# Altium schematic sheet BalloonV1.SchDoc
size 599 x 599 mm
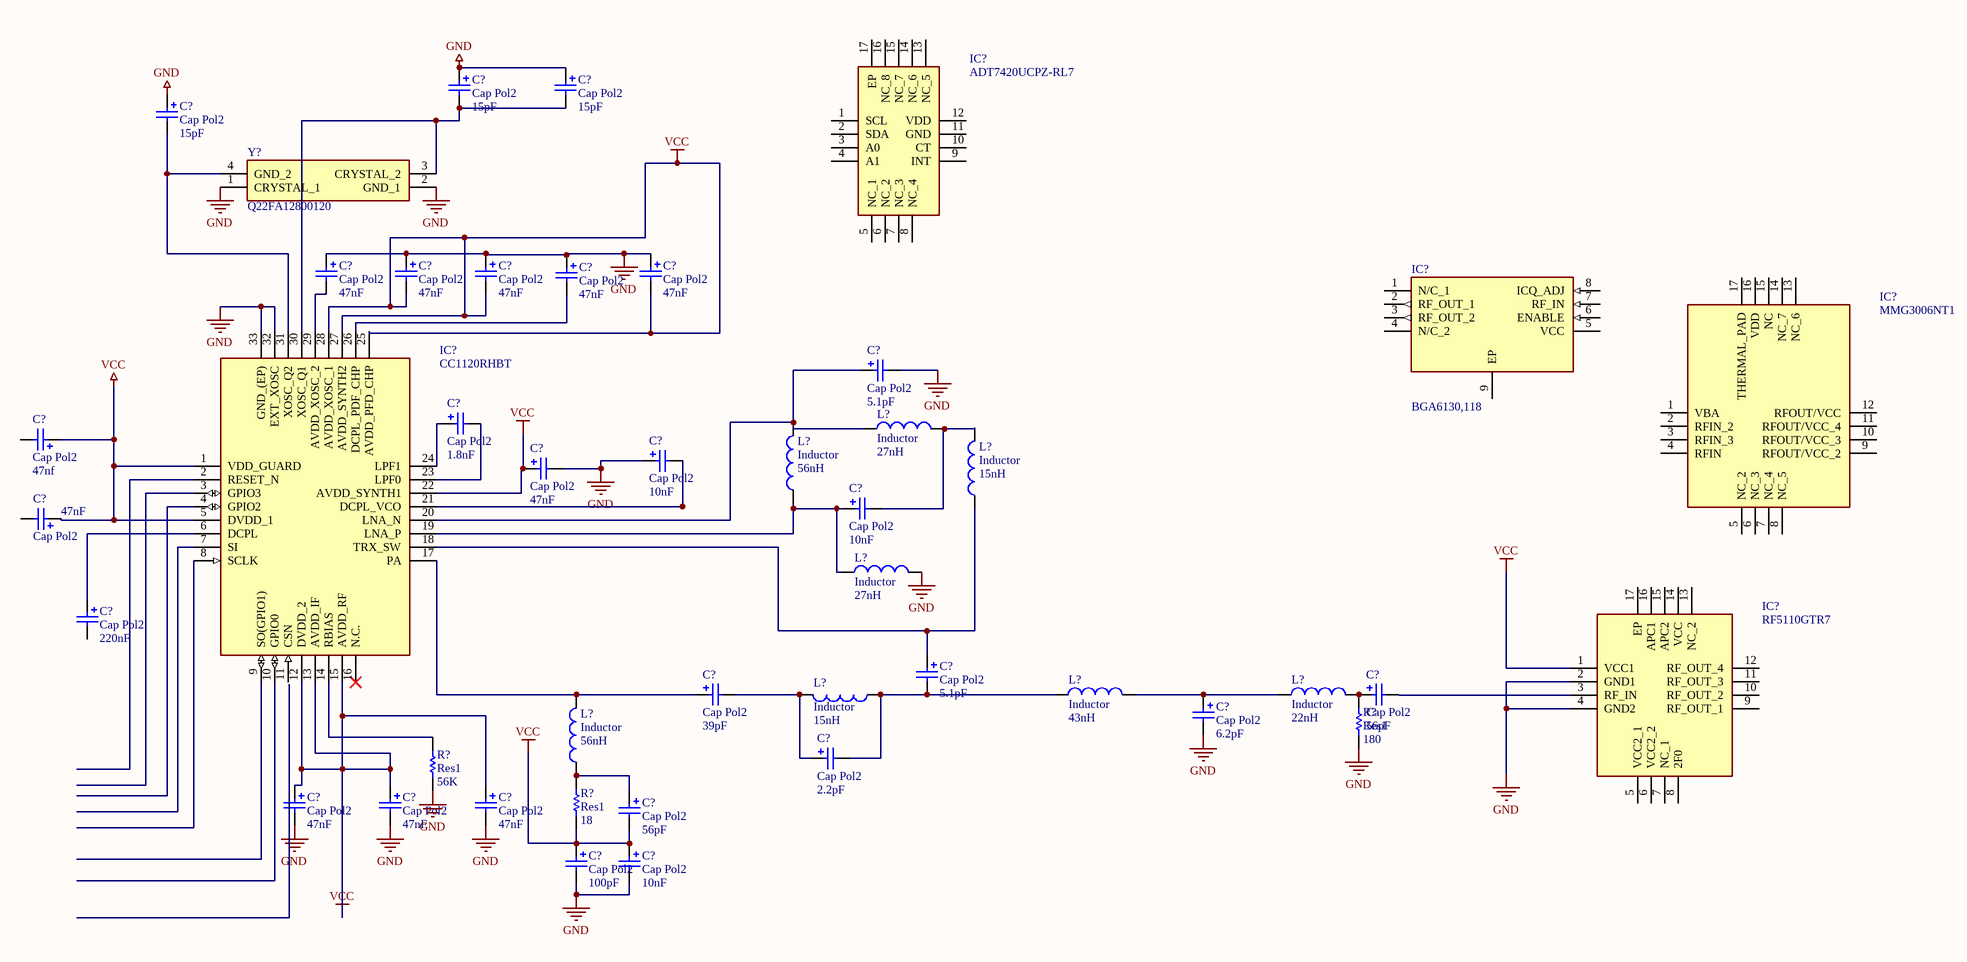
[diagram p0: BalloonV1.SchDoc]

## Parts
(Parts that share a designator on the sheet are numbered #1, #2 ... from top to bottom, then left to right.)
C?#1  Cap Pol2  value 15pF  [POLAR0.8]
C?#2  Cap Pol2  value 15pF  [POLAR0.8]
C?#3  Cap Pol2  value 15pF  [POLAR0.8]
C?#4  Cap Pol2  value 47nF  [POLAR0.8]
C?#5  Cap Pol2  value 47nF  [POLAR0.8]
C?#6  Cap Pol2  value 47nF  [POLAR0.8]
C?#7  Cap Pol2  value 47nF  [POLAR0.8]
C?#8  Cap Pol2  value 47nF  [POLAR0.8]
C?#9  Cap Pol2  value 5.1pF  [POLAR0.8]
C?#10  Cap Pol2  value 1.8nF  [POLAR0.8]
C?#11  Cap Pol2  value 47nf  [POLAR0.8]
C?#12  Cap Pol2  value 10nF  [POLAR0.8]
C?#13  Cap Pol2  value 47nF  [POLAR0.8]
C?#14  Cap Pol2  value 10nF  [POLAR0.8]
C?#15  Cap Pol2  value 47nF  [POLAR0.8]
C?#16  Cap Pol2  value 220nF  [POLAR0.8]
C?#17  Cap Pol2  value 5.1pF  [POLAR0.8]
C?#18  Cap Pol2  value 39pF  [POLAR0.8]
C?#19  Cap Pol2  value 56pF  [POLAR0.8]
C?#20  Cap Pol2  value 6.2pF  [POLAR0.8]
C?#21  Cap Pol2  value 2.2pF  [POLAR0.8]
C?#22  Cap Pol2  value 47nF  [POLAR0.8]
C?#23  Cap Pol2  value 47nF  [POLAR0.8]
C?#24  Cap Pol2  value 47nF  [POLAR0.8]
C?#25  Cap Pol2  value 56pF  [POLAR0.8]
C?#26  Cap Pol2  value 100pF  [POLAR0.8]
C?#27  Cap Pol2  value 10nF  [POLAR0.8]
IC?#1  ADT7420UCPZ-RL7  [QFN65P400X400X80-17N-D]
IC?#2  BGA6130,118  [SON50P300X300X100-9N]
IC?#3  MMG3006NT1  [QFN65P400X400X90-17N]
IC?#4  CC1120RHBT  [QFN50P500X500X100-33N-D]
IC?#5  RF5110GTR7  [QFN50P300X300X90-17N-D]
L?#1  Inductor  value 27nH  [0402-A]
L?#2  Inductor  value 56nH  [0402-A]
L?#3  Inductor  value 15nH  [0402-A]
L?#4  Inductor  value 27nH  [0402-A]
L?#5  Inductor  value 43nH  [0402-A]
L?#6  Inductor  value 22nH  [0402-A]
L?#7  Inductor  value 15nH  [0402-A]
L?#8  Inductor  value 56nH  [0402-A]
R?#1  Res1  value 180  [AXIAL-0.3]
R?#2  Res1  value 56K  [AXIAL-0.3]
R?#3  Res1  value 18  [AXIAL-0.3]
Y?  Q22FA12800120  [Q22FA12800120]

## Nets
GND: C?#1.1 C?#2.1 C?#3.1 C?#4.1 C?#5.1 C?#6.1 C?#7.1 C?#8.1 C?#9.2 C?#12.1 C?#13.2 C?#20.2 C?#22.2 C?#23.2 C?#24.2 C?#26.2 C?#27.2 IC?#4.32(EXT_XOSC) IC?#4.33(GND_(EP)) IC?#5.2(GND1) IC?#5.4(GND2) L?#4.2 R?#1.1 R?#2.1 Y?.1(CRYSTAL_1) Y?.2(GND_1)
VCC: C?#5.2 C?#6.2 C?#8.2 C?#11.1 C?#13.1 C?#15.1 C?#22.1 C?#23.1 C?#24.1 C?#25.2 C?#26.1 C?#27.1 IC?#4.1(VDD_GUARD) IC?#4.5(DVDD_1) IC?#4.12(DVDD_2) IC?#4.13(AVDD_IF) IC?#4.15(AVDD_RF) IC?#4.22(AVDD_SYNTH1) IC?#4.25(AVDD_PFD_CHP) IC?#4.27(AVDD_SYNTH2) IC?#4.28(AVDD_XOSC_1) IC?#5.1(VCC1) R?#3.1
NetC?#1_2: C?#1.2 C?#2.2 IC?#4.30(XOSC_Q1) Y?.3(CRYSTAL_2)
NetC?#3_2: C?#3.2 IC?#4.31(XOSC_Q2) Y?.4(GND_2)
NetC?#4_2: C?#4.2 IC?#4.29(AVDD_XOSC_2)
NetC?#7_2: C?#7.2 IC?#4.26(DCPL_PDF_CHP)
NetC?#9_1: C?#9.1 IC?#4.20(LNA_N) L?#1.1 L?#2.2
NetC?#10_1: C?#10.1 IC?#4.24(LPF1)
NetC?#10_2: C?#10.2 IC?#4.23(LPF0)
NetC?#12_2: C?#12.2 IC?#4.21(DCPL_VCO)
NetC?#14_1: C?#14.1 IC?#4.19(LNA_P) L?#2.1 L?#4.1
NetC?#14_2: C?#14.2 L?#1.2 L?#3.2
NetC?#16_1: C?#16.1 IC?#4.6(DCPL)
NetC?#17_1: C?#17.1 IC?#4.18(TRX_SW) L?#3.1
NetC?#17_2: C?#17.2 C?#21.2 L?#5.1 L?#7.1
NetC?#18_1: C?#18.1 IC?#4.17(PA) L?#8.2
NetC?#18_2: C?#18.2 C?#21.1 L?#7.2
NetC?#19_1: C?#19.1 L?#6.2 R?#1.2
NetC?#19_2: C?#19.2 IC?#5.3(RF_IN)
NetC?#20_1: C?#20.1 L?#5.2 L?#6.1
NetC?#25_1: C?#25.1 L?#8.1 R?#3.2
NetIC?#4_14: IC?#4.14(RBIAS) R?#2.2

Not connected (* = marked no-connect by the designer): C?#11 2; C?#15 2; C?#16 2; IC?#1 1(SCL) 2(SDA) 3(A0) 4(A1) 5(NC_1) 6(NC_2) 7(NC_3) 8(NC_4) 9(INT) 10(CT) 11(GND) 12(VDD) 13(NC_5) 14(NC_6) 15(NC_7) 16(NC_8) 17(EP); IC?#2 1(N/C_1) 2(RF_OUT_1) 3(RF_OUT_2) 4(N/C_2) 5(VCC) 6(ENABLE) 7(RF_IN) 8(ICQ_ADJ) 9(EP); IC?#3 1(VBA) 2(RFIN_2) 3(RFIN_3) 4(RFIN) 5(NC_2) 6(NC_3) 7(NC_4) 8(NC_5) 9(RFOUT/VCC_2) 10(RFOUT/VCC_3) 11(RFOUT/VCC_4) 12(RFOUT/VCC) 13(NC_6) 14(NC_7) 15(NC) 16(VDD) 17(THERMAL_PAD); IC?#4 2(RESET_N) 3(GPIO3) 4(GPIO2) 7(SI) 8(SCLK) 9(SO(GPIO1)) 10(GPIO0) 11(CSN) 16(N.C.)*; IC?#5 5(VCC2_1) 6(VCC2_2) 7(NC_1) 8(2F0) 9(RF_OUT_1) 10(RF_OUT_2) 11(RF_OUT_3) 12(RF_OUT_4) 13(NC_2) 14(VCC) 15(APC2) 16(APC1) 17(EP)

## Library data of the parts
C?#1-C?#27 = Cap Pol2: Polarized Capacitor (Axial); Published: 8-Jun-2000; LatestRevisionDate: 17-Jul-2002; LatestRevisionNote: Re-released for DXP Platform.; PackageReference: POLAR0.8; Publisher: Altium Limited; PackageDescription: Polarized Capacitor; 2 Leads
IC?#1 = ADT7420UCPZ-RL7: Integrated Circuit; Manufacturer_Name: Analog Devices; Datasheet Link: http://www.mouser.com/ds/2/609/ADT7420-878995.pdf; Height: 0.8mm; Manufacturer_Part_Number: ADT7420UCPZ-RL7; Arrow Part Number: ADT7420UCPZ-RL7; Arrow Price/Stock: https://www.arrow.com/en/products/adt7420ucpz-rl7/analog-devices; Mouser Part Number: 584-ADT7420UCPZ-R7; Mouser Price/Stock: https://www.mouser.co.uk/ProductDetail/Analog-Devices/ADT7420UCPZ-RL7?qs=WIvQP4zGanhbp1N2iZN9Nw%3D%3D
IC?#2 = BGA6130,118: Integrated Circuit; Manufacturer_Name: NXP; Datasheet Link: https://www.nxp.com/docs/en/data-sheet/BGA6130.pdf; Height: 1mm; Manufacturer_Part_Number: BGA6130,118; Arrow Part Number: BGA6130,118; Arrow Price/Stock: https://www.arrow.com/en/products/bga6130118/nxp-semiconductors; Mouser Part Number: 771-BGA6130118; Mouser Price/Stock: https://www.mouser.co.uk/ProductDetail/NXP-Semiconductors/BGA6130118?qs=5C9Q4QJFsuNITkGbQzUNJQ%3D%3D
IC?#3 = MMG3006NT1: Integrated Circuit; Manufacturer_Name: NXP; Datasheet Link: http://www.nxp.com/docs/en/data-sheet/MMG3006NT1.pdf; Manufacturer_Part_Number: MMG3006NT1; Arrow Part Number: MMG3006NT1; Arrow Price/Stock: https://www.arrow.com/en/products/mmg3006nt1/nxp-semiconductors; Mouser Part Number: 841-MMG3006NT1; Mouser Price/Stock: https://www.mouser.com/Search/Refine.aspx?Keyword=841-MMG3006NT1
IC?#4 = CC1120RHBT: Integrated Circuit; Manufacturer_Name: Texas Instruments; Datasheet Link: http://www.ti.com/lit/ds/symlink/cc1120.pdf; Height: 1mm; Manufacturer_Part_Number: CC1120RHBT; Arrow Part Number: CC1120RHBT; Arrow Price/Stock: https://www.arrow.com/en/products/cc1120rhbt/texas-instruments; Mouser Part Number: 595-CC1120RHBT; Mouser Price/Stock: https://www.mouser.co.uk/ProductDetail/Texas-Instruments/CC1120RHBT?qs=uuvYgmlZVOsjgv7%252BLKpyRQ%3D%3D
IC?#5 = RF5110GTR7: Integrated Circuit; Manufacturer_Name: Qorvo; Datasheet Link: https://www.qorvo.com/products/d/da000459; Height: 0.9mm; Manufacturer_Part_Number: RF5110GTR7; Arrow Part Number: RF5110GTR7; Mouser Part Number: 772-RF5110GTR7; Mouser Price/Stock: https://www.mouser.com/Search/Refine.aspx?Keyword=772-RF5110GTR7
L?#1-L?#8 = Inductor: Code_IEC: 1005; Published: 8-Jun-2000; LatestRevisionDate: 29-May-2009; LatestRevisionNote: IPC-7351 Footprint Added.; PackageReference: 0402-A; Publisher: Altium Limited; PackageDescription: Chip Inductor; Code_JEITA: 0402
R?#1-R?#3 = Res1: Resistor; Published: 8-Jun-2000; LatestRevisionDate: 17-Jul-2002; LatestRevisionNote: Re-released for DXP Platform.; PackageReference: AXIAL-0.3; Publisher: Altium Limited; PackageDescription: Axial Device, Thru-Hole; 2 Leads; 0.3 in Pin Spacing
Y? = Q22FA12800120: Crystal or Oscillator; Manufacturer_Name: SEIKO EPSON; Datasheet Link: https://datasheet.lcsc.com/szlcsc/Seiko-Epson-Q22FA12800120_C255879.pdf; Height: 0.5mm; Manufacturer_Part_Number: Q22FA12800120; Arrow Part Number: Q22FA12800120